# Altium schematic sheet fmu.SchDoc: Your title
size A4; Date: 2017/06/29; DrawnBy: ØÁÔÀöÎ; Revision: Alfa 0.1; SheetNumber: 6; SheetTotal: 6; Time: 19:01
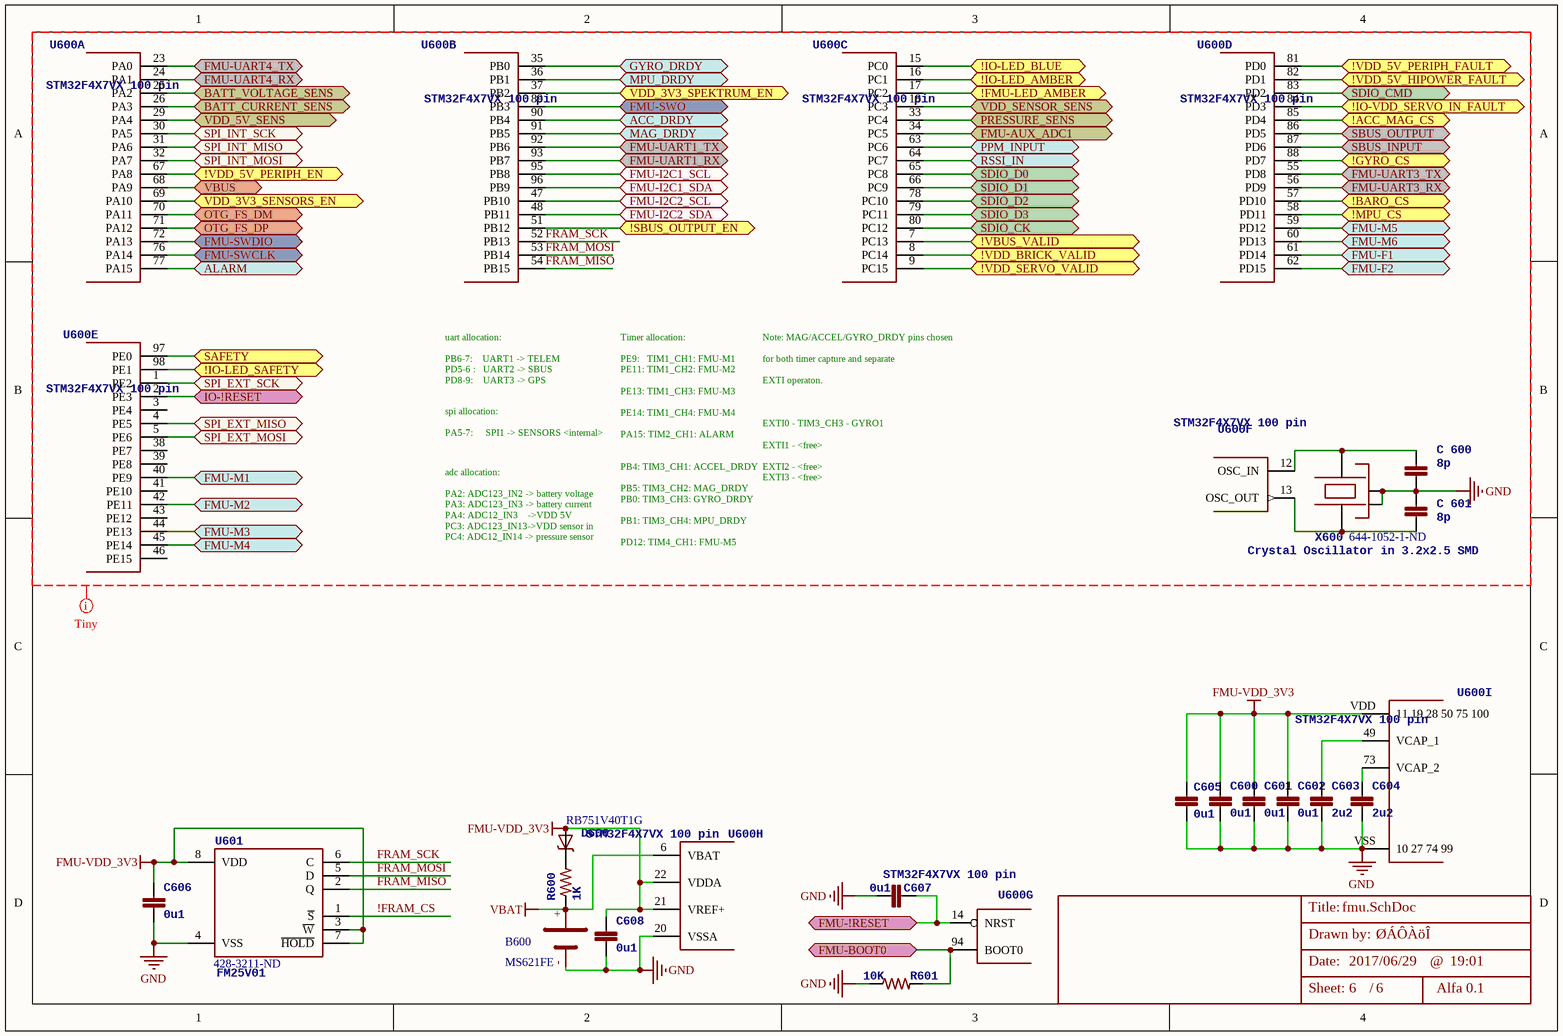
[diagram p0: fmu.SchDoc]

## Parts
B600  MS621FE  [MS621FE]
C600  0u1  [0603-CAP]
C601  0u1  [0603-CAP]
C602  0u1  [0603-CAP]
C603  2u2  [0603-CAP]
C604  2u2  [0603-CAP]
C605  0u1  [0603-CAP]
C606  0u1  [0603-CAP]
C607  0u1  [0603-CAP]
C608  0u1  [0603-CAP]
C_600  8p  [0603-CAP]
C_601  8p  [0603-CAP]
D600  PARTNO: RB751V40T1G  [SOD323]  (hidden comment: Schottky barrier diode)
R600  1K  [0603-RES]
R601  10K  [0603-RES]
U600  STM32F4X7VX 100 pin  [TQFP100]  (parts A,B,C,D,E,F,G,H,I of 9)
U601  FM25V01  Supplier Part Number 1: 428-3211-ND  [SO08]
X600  Crystal Oscillator in 3.2x2.5 SMD  Supplier Part Number 1: 644-1052-1-ND  [OSCILLATOR-3.2X2.5]

## Ports
!ACC_MAG_CS, !BARO_CS, !FMU-LED_AMBER, !GYRO_CS, !IO-LED_AMBER, !IO-LED_BLUE, !IO-LED_SAFETY, !IO-VDD_SERVO_IN_FAULT, !MPU_CS, !SBUS_OUTPUT_EN, !VBUS_VALID, !VDD_5V_HIPOWER_FAULT, !VDD_5V_PERIPH_EN, !VDD_5V_PERIPH_FAULT, !VDD_BRICK_VALID, !VDD_SERVO_VALID, ACC_DRDY, ALARM, BATT_CURRENT_SENS, BATT_VOLTAGE_SENS, FMU-!RESET, FMU-AUX_ADC1, FMU-BOOT0, FMU-F1, FMU-F2, FMU-I2C1_SCL, FMU-I2C1_SDA, FMU-I2C2_SCL, FMU-I2C2_SDA, FMU-M1, FMU-M2, FMU-M3, FMU-M4, FMU-M5, FMU-M6, FMU-SWCLK, FMU-SWDIO, FMU-SWO, FMU-UART1_RX, FMU-UART1_TX, FMU-UART3_RX, FMU-UART3_TX, FMU-UART4_RX, FMU-UART4_TX, GYRO_DRDY, IO-!RESET, MAG_DRDY, MPU_DRDY, OTG_FS_DM, OTG_FS_DP, PPM_INPUT, PRESSURE_SENS, RSSI_IN, SAFETY, SBUS_INPUT, SBUS_OUTPUT, SDIO_CK, SDIO_CMD, SDIO_D0, SDIO_D1, SDIO_D2, SDIO_D3, SPI_EXT_MISO, SPI_EXT_MOSI, SPI_EXT_SCK, SPI_INT_MISO, SPI_INT_MOSI, SPI_INT_SCK, VBUS, VDD_3V3_SENSORS_EN, VDD_3V3_SPEKTRUM_EN, VDD_5V_SENS, VDD_SENSOR_SENS

## Nets
FMU-VDD_3V3: C600.P$1 C601.P$1 C602.P$1 C605.P$1 C606.P$1 C608.P$1 D600.A U600.21(VREF+) U600.22(VDDA) U600.VDD(11_19_28_50_75_100) U601.3(~{W}) U601.7(~{HOLD}) U601.8(VDD)
GND: B600.- C600.P$2 C601.P$2 C602.P$2 C603.P$2 C604.P$2 C605.P$2 C606.P$2 C607.P$1 C608.P$2 C_600.P$2 C_601.P$1 R601.1 U600.20(VSSA) U600.VSS(10_27_74_99) U601.4(VSS) X600.2(NC_2) X600.4(NC_4)
VBAT: B600.+ R600.1 U600.6(VBAT)
!ACC_MAG_CS: U600.85(PD4) ; port !ACC_MAG_CS
!BARO_CS: U600.57(PD10) ; port !BARO_CS
!FMU-LED_AMBER: U600.17(PC2) ; port !FMU-LED_AMBER
!FRAM_CS: U601.1(~{S})
!GYRO_CS: U600.88(PD7) ; port !GYRO_CS
!IO-LED_AMBER: U600.16(PC1) ; port !IO-LED_AMBER
!IO-LED_BLUE: U600.15(PC0) ; port !IO-LED_BLUE
!IO-LED_SAFETY: U600.98(PE1) ; port !IO-LED_SAFETY
!IO-VDD_SERVO_IN_FAULT: U600.84(PD3) ; port !IO-VDD_SERVO_IN_FAULT
!MPU_CS: U600.58(PD11) ; port !MPU_CS
!SBUS_OUTPUT_EN: U600.51(PB12) ; port !SBUS_OUTPUT_EN
!VBUS_VALID: U600.7(PC13) ; port !VBUS_VALID
!VDD_5V_HIPOWER_FAULT: U600.82(PD1) ; port !VDD_5V_HIPOWER_FAULT
!VDD_5V_PERIPH_EN: U600.67(PA8) ; port !VDD_5V_PERIPH_EN
!VDD_5V_PERIPH_FAULT: U600.81(PD0) ; port !VDD_5V_PERIPH_FAULT
!VDD_BRICK_VALID: U600.8(PC14) ; port !VDD_BRICK_VALID
!VDD_SERVO_VALID: U600.9(PC15) ; port !VDD_SERVO_VALID
ACC_DRDY: U600.90(PB4) ; port ACC_DRDY
ALARM: U600.77(PA15) ; port ALARM
BATT_CURRENT_SENS: U600.26(PA3) ; port BATT_CURRENT_SENS
BATT_VOLTAGE_SENS: U600.25(PA2) ; port BATT_VOLTAGE_SENS
FMU-!RESET: C607.P$2 U600.14(NRST) ; port FMU-!RESET
FMU-AUX_ADC1: U600.34(PC5) ; port FMU-AUX_ADC1
FMU-BOOT0: R601.2 U600.94(BOOT0) ; port FMU-BOOT0
FMU-F1: U600.61(PD14) ; port FMU-F1
FMU-F2: U600.62(PD15) ; port FMU-F2
FMU-I2C1_SCL: U600.95(PB8) ; port FMU-I2C1_SCL
FMU-I2C1_SDA: U600.96(PB9) ; port FMU-I2C1_SDA
FMU-I2C2_SCL: U600.47(PB10) ; port FMU-I2C2_SCL
FMU-I2C2_SDA: U600.48(PB11) ; port FMU-I2C2_SDA
FMU-M1: U600.40(PE9) ; port FMU-M1
FMU-M2: U600.42(PE11) ; port FMU-M2
FMU-M3: U600.44(PE13) ; port FMU-M3
FMU-M4: U600.45(PE14) ; port FMU-M4
FMU-M5: U600.59(PD12) ; port FMU-M5
FMU-M6: U600.60(PD13) ; port FMU-M6
FMU-SWCLK: U600.76(PA14) ; port FMU-SWCLK
FMU-SWDIO: U600.72(PA13) ; port FMU-SWDIO
FMU-SWO: U600.89(PB3) ; port FMU-SWO
FMU-UART1_RX: U600.93(PB7) ; port FMU-UART1_RX
FMU-UART1_TX: U600.92(PB6) ; port FMU-UART1_TX
FMU-UART3_RX: U600.56(PD9) ; port FMU-UART3_RX
FMU-UART3_TX: U600.55(PD8) ; port FMU-UART3_TX
FMU-UART4_RX: U600.24(PA1) ; port FMU-UART4_RX
FMU-UART4_TX: U600.23(PA0) ; port FMU-UART4_TX
FRAM_MISO: U600.54(PB15) U601.2(Q)
FRAM_MOSI: U600.53(PB14) U601.5(D)
FRAM_SCK: U600.52(PB13) U601.6(C)
GYRO_DRDY: U600.35(PB0) ; port GYRO_DRDY
IO-!RESET: U600.2(PE3) ; port IO-!RESET
MAG_DRDY: U600.91(PB5) ; port MAG_DRDY
MPU_DRDY: U600.36(PB1) ; port MPU_DRDY
OTG_FS_DM: U600.70(PA11) ; port OTG_FS_DM
OTG_FS_DP: U600.71(PA12) ; port OTG_FS_DP
PPM_INPUT: U600.63(PC6) ; port PPM_INPUT
PRESSURE_SENS: U600.33(PC4) ; port PRESSURE_SENS
RSSI_IN: U600.64(PC7) ; port RSSI_IN
SAFETY: U600.97(PE0) ; port SAFETY
SBUS_INPUT: U600.87(PD6) ; port SBUS_INPUT
SBUS_OUTPUT: U600.86(PD5) ; port SBUS_OUTPUT
SDIO_CK: U600.80(PC12) ; port SDIO_CK
SDIO_CMD: U600.83(PD2) ; port SDIO_CMD
SDIO_D0: U600.65(PC8) ; port SDIO_D0
SDIO_D1: U600.66(PC9) ; port SDIO_D1
SDIO_D2: U600.78(PC10) ; port SDIO_D2
SDIO_D3: U600.79(PC11) ; port SDIO_D3
SPI_EXT_MISO: U600.4(PE5) ; port SPI_EXT_MISO
SPI_EXT_MOSI: U600.5(PE6) ; port SPI_EXT_MOSI
SPI_EXT_SCK: U600.1(PE2) ; port SPI_EXT_SCK
SPI_INT_MISO: U600.31(PA6) ; port SPI_INT_MISO
SPI_INT_MOSI: U600.32(PA7) ; port SPI_INT_MOSI
SPI_INT_SCK: U600.30(PA5) ; port SPI_INT_SCK
VBUS: U600.68(PA9) ; port VBUS
VDD_3V3_SENSORS_EN: U600.69(PA10) ; port VDD_3V3_SENSORS_EN
VDD_3V3_SPEKTRUM_EN: U600.37(PB2) ; port VDD_3V3_SPEKTRUM_EN
VDD_5V_SENS: U600.29(PA4) ; port VDD_5V_SENS
VDD_SENSOR_SENS: U600.18(PC3) ; port VDD_SENSOR_SENS
NetC603_P$1: C603.P$1 U600.49(VCAP_1)
NetC604_P$1: C604.P$1 U600.73(VCAP_2)
NetC_600_P$1: C_600.P$1 U600.12(OSC_IN) X600.3
NetC_601_P$2: C_601.P$2 U600.13(OSC_OUT) X600.1
NetD600_C: D600.C R600.2

Not connected (* = marked no-connect by the designer): U600 3(PE4) 38(PE7) 39(PE8) 41(PE10) 43(PE12) 46(PE15)

## Layout directives
net class Tiny_componet: FRAM_MISO, FRAM_MOSI, FRAM_SCK, GND

## Notes on the sheet
- uart allocation:
  PB6-7:    UART1 -> TELEM
  PD5-6 :   UART2 -> SBUS
  PD8-9:    UART3 -> GPS
  PA0-1 :   UART4 -> DEBUG
- spi allocation:
  PA5-7:     SPI1 -> SENSORS <internal>
  PB13-15: SPI2 -> FRAM
  PE2,5,6:  SPI4 -> external SPI
- Note: MAG/ACCEL/GYRO_DRDY pins chosen
  for both timer capture and separate
  EXTI operaton.
  EXTI0 - TIM3_CH3 - GYRO1
  EXTI1 - <free>
  EXTI2 - <free>
  EXTI3 - <free>
  EXTI4 - TIM3_CH1 - ACCEL
  EXTI5-9 - TIM3_CH2 - MAG
- adc allocation:
  PA2: ADC123_IN2 -> battery voltage
  PA3: ADC123_IN3 -> battery current
  PA4: ADC12_IN3    ->VDD 5V
  PC3: ADC123_IN13->VDD sensor in
  PC4: ADC12_IN14 -> pressure sensor
  PC5: ADC12_IN15 -> aux adc in #1
- Timer allocation:
  PE9:   TIM1_CH1: FMU-M1
  PE11: TIM1_CH2: FMU-M2
  PE13: TIM1_CH3: FMU-M3
  PE14: TIM1_CH4: FMU-M4
  PA15: TIM2_CH1: ALARM
  PB4: TIM3_CH1: ACCEL_DRDY
  PB5: TIM3_CH2: MAG_DRDY
  PB0: TIM3_CH3: GYRO_DRDY
  PB1: TIM3_CH4: MPU_DRDY
  PD12: TIM4_CH1: FMU-M5
  PD13: TIM4_CH2: FMU-M6
  PD14: TIM4_CH3: FMU-F1
  PD15: TIM4_CH4: FMU-F2
  PC6: TIM8_CH1:PPM_IN
  PC7: TIM8_CH2:RSSI_IN
- Title:
- Date:
- Drawn by:
- @
- Sheet:       /

## Library data of the parts
B600 = MS621FE: MS Lithium Rechargeable Battery
C600-C608 C_600 C_601 = CAP0603: CAP CER 2.2UF 16V 10% X6S 0603; PARTNO: C1608X6S1C225K080AC; 3DR_PARTNO: ECM0619; Supplier 1: Digi-Key; Supplier Part Number 1: 445-7438-1-ND
  C600-C602 C605-C608: Value: 0u1
  C603 C604: Value: 2u2
  C_600 C_601: Value: 8p
D600 = DIODE-SCHOTTKY_SOD323: DIODE SCHOTTKY 30V 0.03A SOD323; 3DR_PARTNO: ECM0839; Supplier 1: Digi-Key; Value: 30V; Supplier Part Number 1: RB751V40T1GOSCT-ND
R600 R601 = RESISTOR0603-RES: RES 10 OHM 1/10W 5% 0603; PARTNO: RC1608J100CS; 3DR_PARTNO: ECM0811; Supplier 1: Digi-Key; Supplier Part Number 1: 1276-5014-1-ND
  R600: Value: 1K
  R601: Value: 10K
U600 = STM32F4X7VX_1: REV 3 Silicon or later IC MCU ARM 2MB FLASH 100LQFP; 3DR_PARTNO: ECM0841; Supplier 1: Digi-Key
U601 = FM25V01: IC FRAM 128KBIT 40MHZ 8SOIC; PARTNO: FM25V01-G; 3DR_PARTNO: ECM0826; Value: 128k; DATASHEET: http://www.ramtron.com/files/datasheets/FM25V01_ds.pdf; LINK: http://www.digikey.com/product-detail/en/FM25V01-GTR/1140-1026-1-ND/2809832; MFGPN: FM25V01; Supplier 1: Digi-Key
X600 = OSCILLATOR-3.2X2.5: CRYSTAL 24MHZ 8PF SMD; 3DR_PARTNO: ECM0708; PARTNO: NX3225SA-24.000MHZ-STD-CSR-1; Supplier 1: Digi-Key; Value: 24MHz